# EAGLE design audio_breakout (EAGLE 7.2.1)
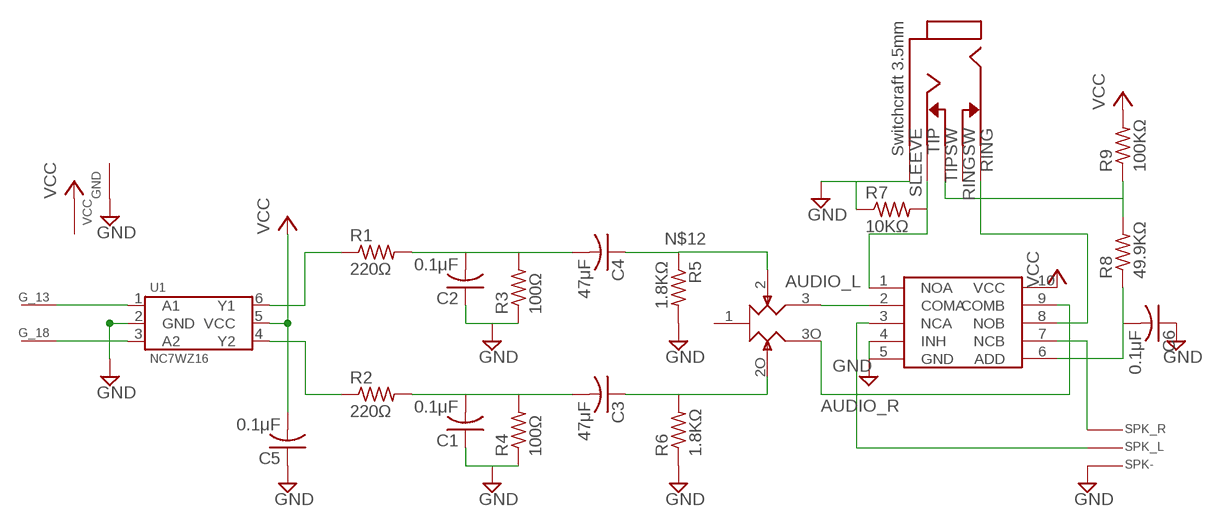
[diagram p0: schematic, sheet 1]

## Parts
C1  0.1μF  C-USC0603  [C0603]
C2  0.1μF  C-USC0603  [C0603]
C3  47μF  C-USC0603  [C0603]
C4  47μF  C-USC0603  [C0603]
C5  0.1μF  C-USC0603  [C0603]
C6  0.1μF  C-USC0603  [C0603]
G_13  THROUGH-HOLE  [THROUGH-HOLE]
G_18  THROUGH-HOLE  [THROUGH-HOLE]
GND  THROUGH-HOLE  [THROUGH-HOLE]
R1  220Ω  R-US_R0603  [R0603]
R2  220Ω  R-US_R0603  [R0603]
R3  100Ω  R-US_R0603  [R0603]
R4  100Ω  R-US_R0603  [R0603]
R5  1.8KΩ  R-US_R0603  [R0603]
R6  1.8KΩ  R-US_R0603  [R0603]
R7  10KΩ  R-US_R0603  [R0603]
R8  49.9KΩ  R-US_R0603  [R0603]
R9  100KΩ  R-US_R0603  [R0603]
SPK-  THROUGH-HOLE  [THROUGH-HOLE]
SPK_L  THROUGH-HOLE  [THROUGH-HOLE]
SPK_R  THROUGH-HOLE  [THROUGH-HOLE]
U1  NC7WZ16  [SC-70-6]
U2  MAX4525L  [UMAX10]
U$2  SWTCHCRFT_3.5JACK5-JACK-SMD  [4-JACK-SMD]
U$3  10K  RK10J12E0A0A  [RK10J12E0A0A]
VCC  THROUGH-HOLE  [THROUGH-HOLE]

## Nets
AUDIO_L: U2.2(COMA) U$3.3
AUDIO_R: U2.9(COMB) U$3.3O
GND: C1.1 C2.1 C5.1 C6.1 GND.P$1 R3.1 R4.1 R5.2 R6.1 R7.1 SPK-.P$1 U1.2(GND) U2.4(INH) U2.5(GND) U$2.1
N$1: R1.1 U1.6(Y1)
N$2: R2.1 U1.4(Y2)
N$3: C1.2 C3.2 R2.2 R4.2
N$4: C2.2 C4.2 R1.2 R3.2
N$5: R8.2 R9.1 U$2.5
N$6: C6.2 R8.1 U2.6(ADD)
N$7: G_18.P$1 U1.3(A2)
N$8: G_13.P$1 U1.1(A1)
N$9: SPK_R.P$1 U2.7(NCB)
N$10: R7.2 U2.1(NOA) U$2.3
N$11: U2.8(NOB) U$2.2
N$12: C4.1 R5.1 U$3.2
N$13: SPK_L.P$1 U2.3(NCA)
N$14: C3.1 R6.2 U$3.2O
VCC: C5.2 R9.2 U1.5(VCC) U2.10(VCC) VCC.P$1
Unconnected: U$2.4 U$3.1

## Library data of the parts
C1-C6 = rcl:C-US: CAPACITOR, American symbol
G_13 G_18 GND SPK- SPK_L SPK_R VCC = pot:THROUGH-HOLE
R1-R9 = resistor:R-US_: RESISTOR, American symbol
U1 = fairchild:NC7WZ16
U2 = ref-packages:MAX4525L
U$2 = jmsaavedra:SWTCHCRFT_3.5JACK: Switchcraft 3.5mm Stereo Audio Jack manufacturer: 35RASMT4BHNTRX digikey: SC1488-1-ND
U$3 = pot:RK10J12E0A0A

## Board
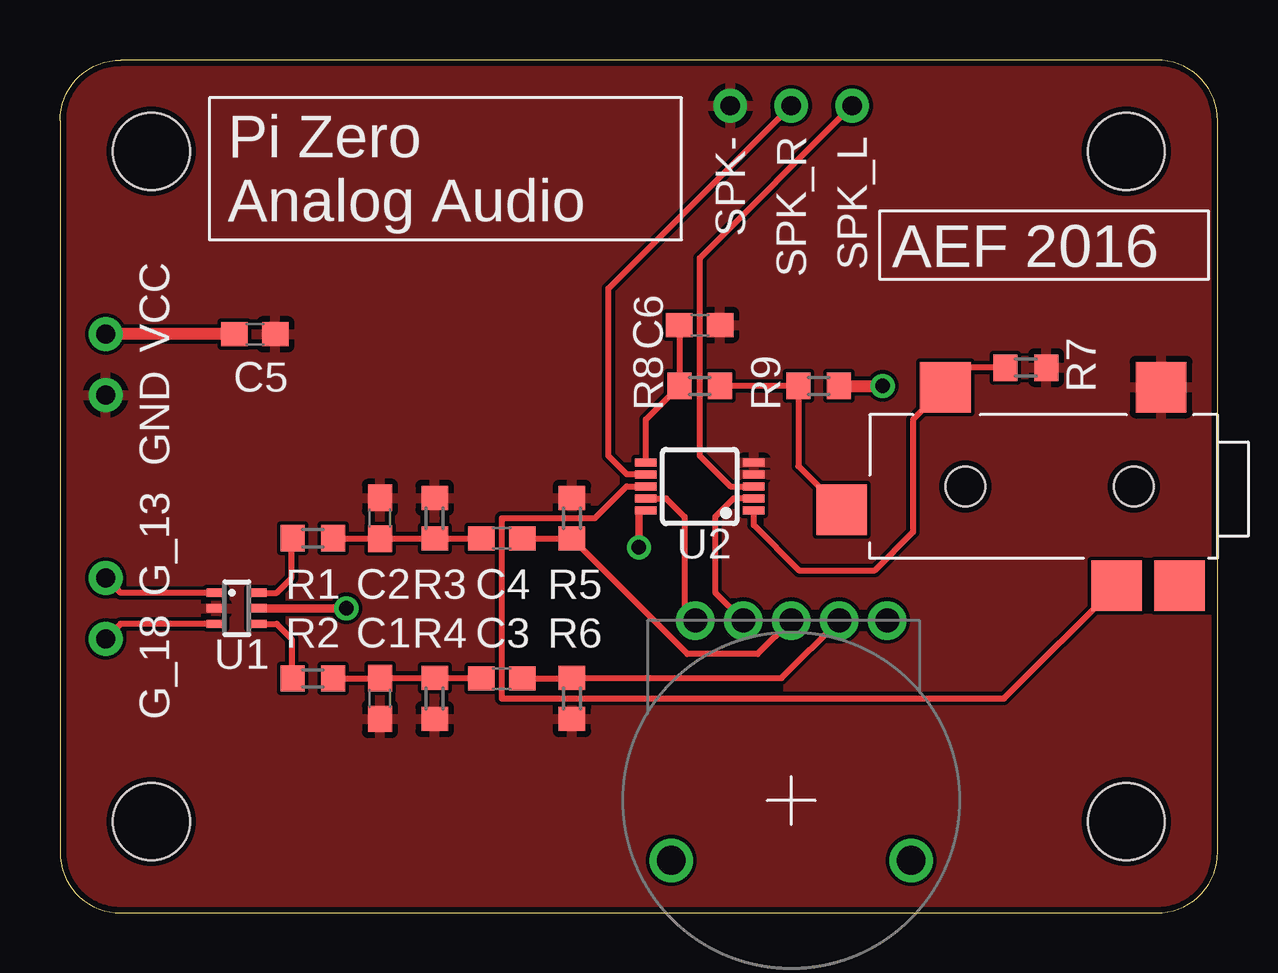
[diagram p1: board, top side]
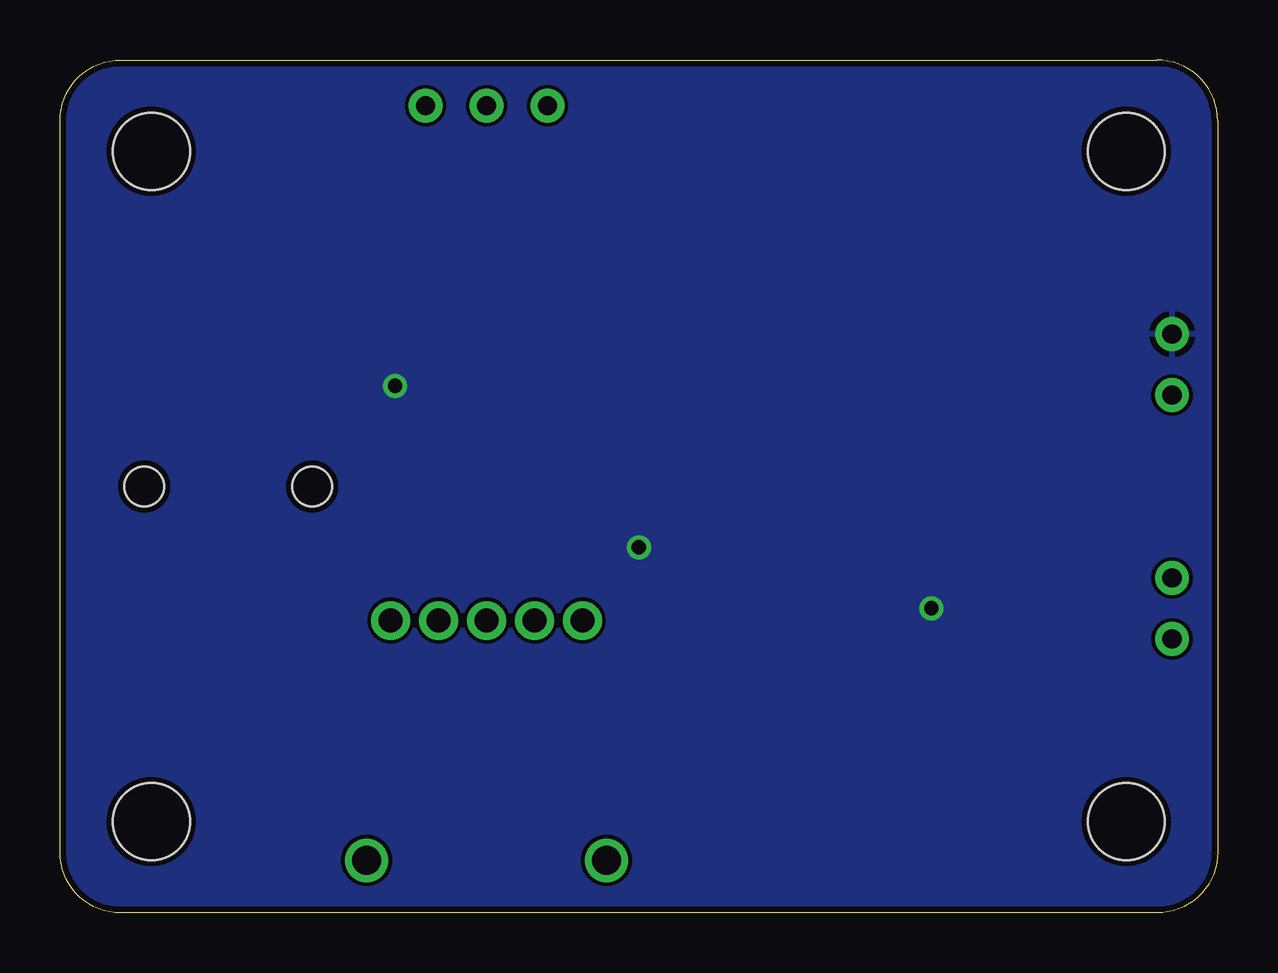
[diagram p2: board, bottom side, seen from below]

Size 48.26 x 35.56 mm. Coordinates in mm from the lower left corner, seen from the top.
Outline: 2.54,0 45.72,0 arc90 48.26,2.54 48.26,33.02 arc90 45.72,35.56 2.54,35.56 arc90 0,33.02 0,2.54 arc90 2.54,0
Copper layers (1*16): Top 0.035mm / dielectric 1.5mm / Bottom 0.035mm
Design rules "DFRobot_Eagle_Rule_v0.4": minimum track width 6mil, minimum drill 12mil, track to track 6mil, track to pad 6mil, pad to pad 6mil, via to via 6mil, smd to smd 0mil, copper to edge 10mil, drill to drill 10mil, minimum pad ring 12mil, minimum via ring 8mil, stop-mask expansion 2mil, vias tented up to drill 25mil, thermal gap 10mil
Holes 3.2 mm at 3.81,31.75 3.81,3.81 44.45,3.81 44.45,31.75

### Footprints (pad centres in the part's own frame; a part is rotated, then mirrored left to right if it is on the bottom)
C0603 = smd 1.1 x 1: 1 -0.85,0; 2 0.85,0
THROUGH-HOLE = drill 0.8: P$1 0,0
R0603 = smd 1 x 1.1: 1 -0.85,0; 2 0.85,0
SC-70-6 = smd 0.8 x 0.35: 1 -0.85,0.65; 2 -0.85,0; 3 -0.85,-0.65; 4 0.85,-0.65; 5 0.85,0; 6 0.85,0.65
UMAX10 = smd 0.32 x 0.9: 1 -1,-2.25; 2 -0.5,-2.25; 3 0,-2.25; 4 0.5,-2.25; 5 1,-2.25; 6 1,2.25; 7 0.5,2.25; 8 0,2.25; 9 -0.5,2.25; 10 -1,2.25
4-JACK-SMD = smd 2.108 x 2.108: 1 2.362,-1.143; 2 4.216,7.137; 3 11.354,-1.143; 4 1.6,7.137; 5 15.672,3.962 | hole 1.651: 3.505,2.997; 10.516,2.997
RK10J12E0A0A = drill 1: 1 -4,0; 2 0,0; 2O -2,0; 3 2,0; 3O 4,0 | drill 1.2: P$6 -5,10; P$7 5,10

### Placement (x,y rotation side)
C1  13.34,8.94 90 top
C2  13.34,16.46 270 top
C3  18.41,9.78 180 top
C4  18.41,15.62 180 top
C5  8.13,24.13 180 top
C6  26.67,24.51 180 top
G_13  1.91,13.97 0 top
G_18  1.91,11.43 0 top
GND  1.91,21.59 0 top
R1  10.54,15.62 0 top
R2  10.54,9.78 0 top
R3  15.62,16.46 270 top
R4  15.62,8.94 90 top
R5  21.34,16.46 90 top
R6  21.34,8.94 90 top
R7  40.26,22.73 180 top
R8  26.67,21.97 0 top
R9  31.62,21.97 0 top
SPK-  27.94,33.66 0 top
SPK_L  33.02,33.66 0 top
SPK_R  30.48,33.66 0 top
U1  7.37,12.7 0 top
U2  26.67,17.78 90 top
U$2  48.26,20.78 180 top
U$3  30.48,12.19 180 top
VCC  1.91,24.13 0 top

### Tracks (layer width: path | path; a pad name or v marks a point on that pad's centre or on a via)
AUDIO_L
  Top 0.254: U2.2 28.07,17.28 27.3,16.51 27.3,13.37 U$3.3
AUDIO_R
  Top 0.254: U2.9 25.27,17.28 26.04,16.51 26.04,12.64 U$3.3O
GND
  pour Top: 0,0 48.26,0 48.26,35.56 0,35.56
N$1
  Top 0.254: U1.6 9.03,13.35 9.65,13.97 9.65,15.58 R1.1
N$2
  Top 0.254: U1.4 9.03,12.05 9.65,11.43 9.65,9.82 R2.1
N$3
  Top 0.254: R2.2 C1.2 R4.2 17.57,9.79 C3.2
N$4
  Top 0.254: R1.2 13.34,15.62 C2.2 R3.2 C4.2
N$5
  Top 0.254: U$2.5 30.77,18.63 R9.1 R8.2
N$6
  Top 0.254: C6.2 R8.1 24.42,20.57 U2.6
N$7
  Top 0.254: U1.3 2.52,12.05 G_18.P$1
N$8
  Top 0.254: U1.1 2.52,13.35 G_13.P$1
N$9
  Top 0.254: U2.7 23.63,18.28 22.86,19.05 22.86,26.04 SPK_R.P$1
N$10
  Top 0.254: R7.2 36.91,22.73 U$2.3 35.56,20.57 35.56,15.88 33.97,14.29 30.8,14.29 28.92,16.16 U2.1
N$11
  Top 0.254: 43.81,13.87 U$2.2 39.34,8.94 18.41,8.94 18.41,16.46 22.3,16.46 23.62,17.78 U2.8
N$12
  Top 0.254: C4.1 21.34,15.62 R5.1 26.15,10.79 29.08,10.79 U$3.2
N$13
  Top 0.254: U2.3 27.94,17.78 26.67,19.05 26.67,27.3 SPK_L.P$1
N$14
  Top 0.254: C3.1 R6.2 30.08,9.79 U$3.2O
VCC  (via drill 0.6)
  Top 0.254: U2.10 24.13,16.78
  Top 0.319: 24.13,16.78 v24.13,15.24
  Top 0.348: U1.5 v11.94,12.7
  Top 0.508: R9.2 v34.29,21.97 | C5.2 VCC.P$1
  pour Bottom: 0,0 48.26,0 48.26,35.56 0,35.56

### Text on the board
tPlace: Pi Zero / Analog Audio | AEF 2016